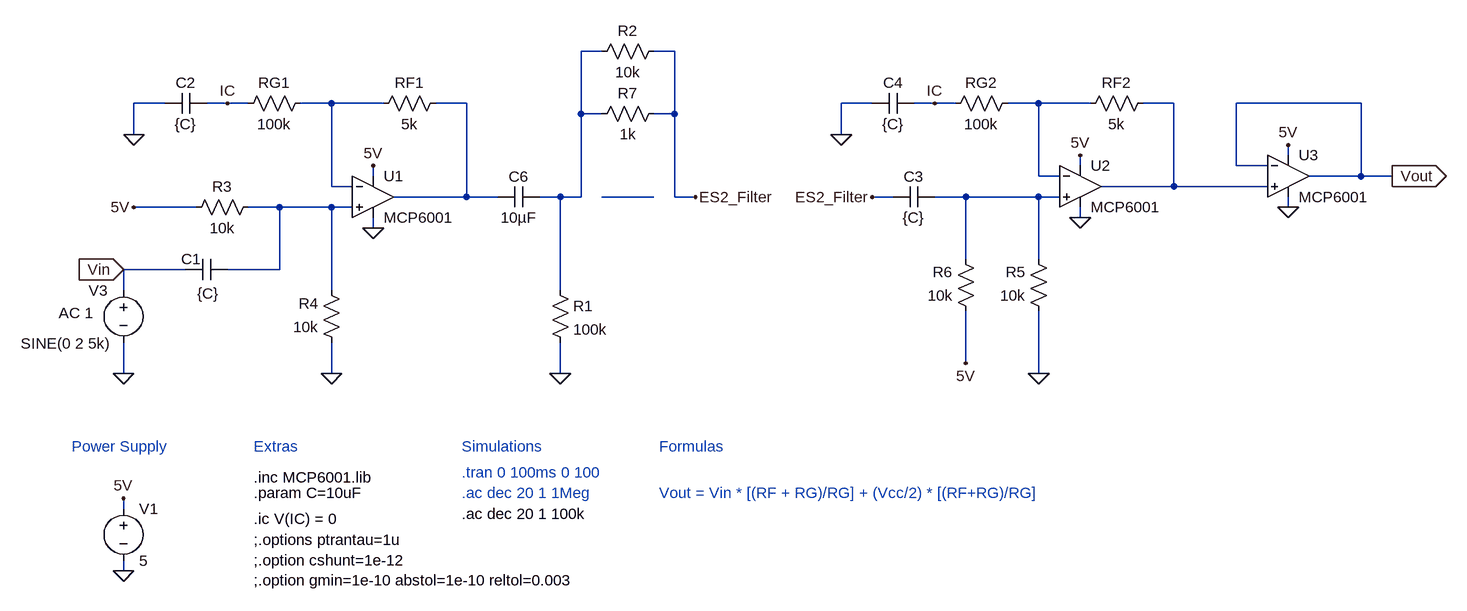
[diagram p0: schematic Student Research.asc]
Student Research.asc, the LTspice schematic file:
Version 4
SHEET 1 1856 952
WIRE 528 16 496 16
WIRE 640 16 608 16
WIRE -144 96 -192 96
WIRE -48 96 -80 96
WIRE -16 96 -48 96
WIRE 112 96 64 96
WIRE 192 96 112 96
WIRE 320 96 272 96
WIRE 944 96 896 96
WIRE 1040 96 1008 96
WIRE 1072 96 1040 96
WIRE 1200 96 1152 96
WIRE 1280 96 1200 96
WIRE 1408 96 1360 96
WIRE 1696 96 1504 96
WIRE 496 112 496 16
WIRE 528 112 496 112
WIRE 640 112 640 16
WIRE 640 112 608 112
WIRE -192 144 -192 96
WIRE 896 144 896 96
WIRE 1584 176 1584 160
WIRE 1264 192 1264 176
WIRE 1504 192 1504 96
WIRE 1552 192 1504 192
WIRE 176 208 176 192
WIRE 1200 208 1200 96
WIRE 1232 208 1200 208
WIRE 1696 208 1696 96
WIRE 1696 208 1616 208
WIRE 1744 208 1696 208
WIRE 112 224 112 96
WIRE 144 224 112 224
WIRE 1408 224 1408 96
WIRE 1408 224 1296 224
WIRE 1552 224 1408 224
WIRE 320 240 320 96
WIRE 320 240 208 240
WIRE 368 240 320 240
WIRE 464 240 432 240
WIRE 496 240 496 112
WIRE 496 240 464 240
WIRE 608 240 528 240
WIRE 640 240 640 112
WIRE 672 240 640 240
WIRE 976 240 944 240
WIRE 1088 240 1040 240
WIRE 1200 240 1088 240
WIRE 1232 240 1200 240
WIRE -96 256 -192 256
WIRE 32 256 -16 256
WIRE 112 256 32 256
WIRE 144 256 112 256
WIRE 1584 256 1584 240
WIRE 1264 272 1264 256
WIRE 176 288 176 272
WIRE 1088 336 1088 240
WIRE 1200 336 1200 240
WIRE -112 352 -208 352
WIRE 32 352 32 256
WIRE 32 352 -48 352
WIRE -208 384 -208 352
WIRE 112 384 112 256
WIRE 464 384 464 240
WIRE 1088 496 1088 416
WIRE -208 512 -208 464
WIRE 112 512 112 464
WIRE 464 512 464 464
WIRE 1200 512 1200 416
WIRE -208 720 -208 704
WIRE -208 816 -208 800
FLAG -208 816 0
FLAG -208 704 5V
FLAG 176 192 5V
FLAG 176 288 0
FLAG 112 512 0
FLAG -208 512 0
FLAG -192 256 5V
FLAG 1200 512 0
FLAG 1088 496 5V
FLAG 1264 272 0
FLAG 1264 176 5V
FLAG 1584 160 5V
FLAG 1584 256 0
FLAG -48 96 IC
FLAG 1040 96 IC
FLAG -192 144 0
FLAG 896 144 0
FLAG 672 240 ES2_Filter
FLAG 944 240 ES2_Filter
FLAG 464 512 0
FLAG -208 352 Vin
IOPIN -208 352 In
FLAG 1744 208 Vout
IOPIN 1744 208 Out
SYMBOL res 80 80 R90
WINDOW 0 0 56 VBottom 2
WINDOW 3 32 56 VTop 2
SYMATTR InstName RG1
SYMATTR Value 100k
SYMBOL res 288 80 R90
WINDOW 0 0 56 VBottom 2
WINDOW 3 32 56 VTop 2
SYMATTR InstName RF1
SYMATTR Value 5k
SYMBOL voltage -208 704 R0
WINDOW 123 0 0 Left 0
WINDOW 39 0 0 Left 0
SYMATTR InstName V1
SYMATTR Value 5
SYMBOL res 0 240 R90
WINDOW 0 0 56 VBottom 2
WINDOW 3 32 56 VTop 2
SYMATTR InstName R3
SYMATTR Value 10k
SYMBOL MCP6001 176 176 R0
SYMATTR InstName U1
SYMBOL res 128 480 R180
WINDOW 0 36 76 Left 2
WINDOW 3 36 40 Left 2
SYMATTR InstName R4
SYMATTR Value 10k
SYMBOL cap -48 336 R90
WINDOW 0 15 56 VBottom 2
WINDOW 3 37 30 VTop 2
SYMATTR InstName C1
SYMATTR Value {C}
SYMBOL voltage -208 368 M0
WINDOW 3 20 98 Left 2
WINDOW 123 46 51 Left 2
WINDOW 39 0 0 Left 0
SYMATTR Value SINE(0 2 5k)
SYMATTR Value2 AC 1
SYMATTR InstName V3
SYMBOL cap -80 80 R90
WINDOW 0 0 32 VBottom 2
WINDOW 3 32 32 VTop 2
SYMATTR InstName C2
SYMATTR Value {C}
SYMBOL res 1216 432 R180
WINDOW 0 36 76 Left 2
WINDOW 3 36 40 Left 2
SYMATTR InstName R5
SYMATTR Value 10k
SYMBOL res 1104 432 R180
WINDOW 0 36 76 Left 2
WINDOW 3 36 40 Left 2
SYMATTR InstName R6
SYMATTR Value 10k
SYMBOL cap 1008 80 R90
WINDOW 0 0 32 VBottom 2
WINDOW 3 32 32 VTop 2
SYMATTR InstName C4
SYMATTR Value {C}
SYMBOL res 1168 80 R90
WINDOW 0 0 56 VBottom 2
WINDOW 3 32 56 VTop 2
SYMATTR InstName RG2
SYMATTR Value 100k
SYMBOL res 1376 80 R90
WINDOW 0 0 56 VBottom 2
WINDOW 3 32 56 VTop 2
SYMATTR InstName RF2
SYMATTR Value 5k
SYMBOL cap 1040 224 R90
WINDOW 0 0 32 VBottom 2
WINDOW 3 32 32 VTop 2
SYMATTR InstName C3
SYMATTR Value {C}
SYMBOL MCP6001 1264 160 R0
SYMATTR InstName U2
SYMBOL MCP6001 1584 144 R0
SYMATTR InstName U3
SYMBOL cap 432 224 R90
WINDOW 0 0 32 VBottom 2
WINDOW 3 32 32 VTop 2
SYMATTR InstName C6
SYMATTR Value 10µF
SYMBOL res 448 368 R0
SYMATTR InstName R1
SYMATTR Value 100k
SYMBOL res 512 128 R270
WINDOW 0 32 56 VTop 2
WINDOW 3 0 56 VBottom 2
SYMATTR InstName R7
SYMATTR Value 1k
SYMBOL res 512 32 R270
WINDOW 0 32 56 VTop 2
WINDOW 3 0 56 VBottom 2
SYMATTR InstName R2
SYMATTR Value 10k
TEXT 312 728 Left 2 !.ac dec 20 1 100k
TEXT -8 672 Left 2 !.inc MCP6001.lib
TEXT -8 696 Left 2 !.param C=10uF
TEXT 312 696 Left 2 ;.ac dec 20 1 1Meg
TEXT -288 624 Left 2 ;Power Supply
TEXT -8 624 Left 2 ;Extras
TEXT 312 624 Left 2 ;Simulations
TEXT 616 624 Left 2 ;Formulas
TEXT 616 696 Left 2 ;Vout = Vin * [(RF + RG)/RG] + (Vcc/2) * [(RF+RG)/RG]
TEXT -8 736 Left 2 !.ic V(IC) = 0
TEXT -8 768 Left 2 !;.options ptrantau=1u\n;.option cshunt=1e-12\n;.option gmin=1e-10 abstol=1e-10 reltol=0.003
TEXT 312 664 Left 2 ;.tran 0 100ms 0 100

The netlist it stands for:
* Student Research.asc
RG1 N002 IC 100k
RF1 N003 N002 5k
V1 5V 0 5
R3 N008 5V 10k
* U1: MCP6001 (symbol MCP6001 not available, pins judged from their places): In+=N008 In-=N002 V+=5V V-=0 OUT=N003
R4 0 N008 10k
C1 N008 Vin {C}
V3 Vin 0 SINE(0 2 5k) AC 1
C2 IC 0 {C}
R5 0 N007 10k
R6 5V N007 10k
C4 IC 0 {C}
RG2 N004 IC 100k
RF2 N005 N004 5k
C3 N007 ES2_Filter {C}
* U2: MCP6001 (symbol MCP6001 not available, pins judged from their places): In+=N007 In-=N004 V+=5V V-=0 OUT=N005
* U3: MCP6001 (symbol MCP6001 not available, pins judged from their places): In+=N005 In-=Vout V+=5V V-=0 OUT=Vout
C6 N001 N003 10µF
R1 N001 0 100k
R7 N001 ES2_Filter 1k
R2 N001 ES2_Filter 10k
.ac dec 20 1 100k
.inc MCP6001.lib
.param C=10uF
* .ac dec 20 1 1Meg
* Power Supply
* Extras
* Simulations
* Formulas
* Vout = Vin * [(RF + RG)/RG] + (Vcc/2) * [(RF+RG)/RG]
.ic V(IC) = 0
;.options ptrantau=1u
;.option cshunt=1e-12
;.option gmin=1e-10 abstol=1e-10 reltol=0.003
* .tran 0 100ms 0 100
.backanno
.end